# EAGLE design H0BR4 (EAGLE 9.6.1)

## Sheet 1 of 2
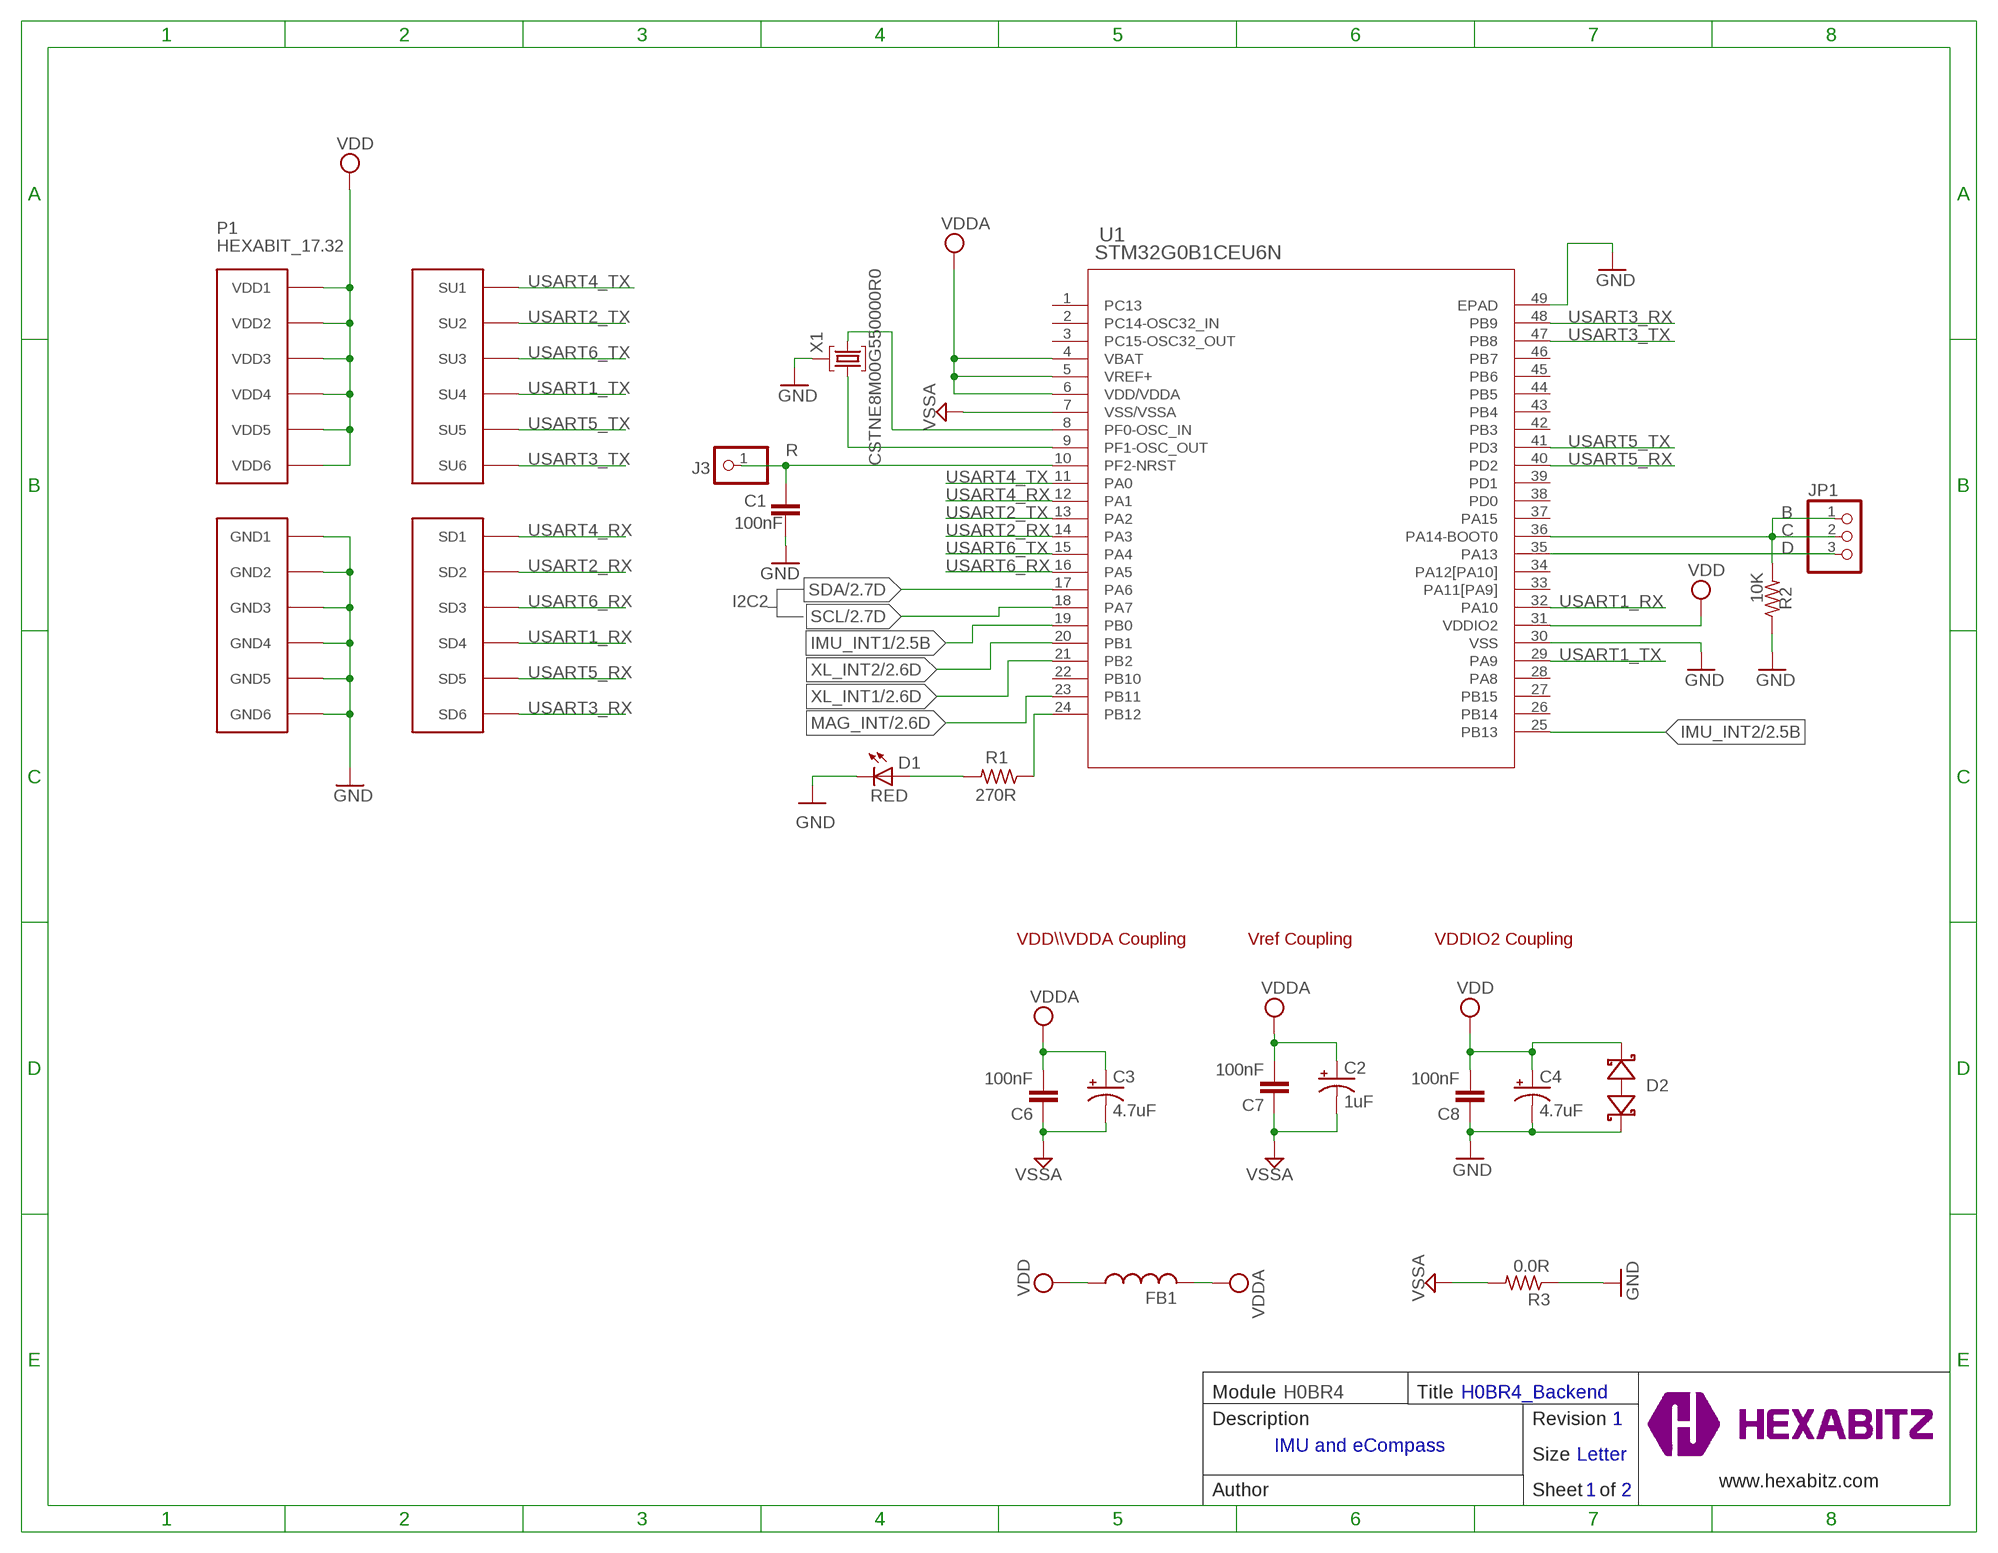
[diagram p0: schematic, sheet 1]

### Parts
C1  100nF  C-0603  [C-0603]
C2  1uF  C-0805-POL  [C-0805-POL]
C3  4.7uF  C-0805-POL  [C-0805-POL]
C4  4.7uF  C-0805-POL  [C-0805-POL]
C6  100nF  C-0603  [C-0603]
C7  100nF  C-0603  [C-0603]
C8  100nF  C-0603  [C-0603]
D1  RED  VLMS1300-GS08  [VLMS1300-GS08]
D2  BOURNS_CDSOD323-T03SCBOURNS_CDSOD323-T03SC_0_0  [BOURNS_CDSOD323-T03SC_0]
FB1  FB-TDK_MMZ1608Y300B  [FB-TDK_MMZ1608Y300B]
J3  PINHD-1X1  [1X01]
JP1  PINHD-1X3  [1X03]
P1  HEXABIT_17.32  [HEXABIT_17.32]
R1  270R  R-0603  [R-0603]
R2  10K  R-0603  [R-0603]
R3  0.0R  R-0603  [R-0603]
TRIMBLE-LOGO1  HEXA-LOGO  [HEXA-LOGO]
U1  STM32G0B1CEU6N  [HEXABITZ_ICS_QFN_B1CEU6_STM-L]
X1  CSTNE8M00G550000R0  XTALL_CSTCE8M00G52  [XTALL_CSTCE8M00G52]

### Nets
C: JP1.1 JP1.2 R2.2 U1.36(PA14-BOOT0)
D: JP1.3 U1.35(PA13)
GND: C1.1 C4.2(-) C8.1 D1.C D2.1(A) P1.PAD_PD7(GND1) P1.PAD_PD8(GND2) P1.PAD_PD9(GND3) P1.PAD_PD10(GND4) P1.PAD_PD11(GND5) P1.PAD_PD12(GND6) R2.1 R3.1 U1.30(VSS) U1.49(EPAD) X1.P$2 ; also sheet 2
GND1: C2.2(-) C3.2(-) C6.1 C7.1 R3.2 U1.7(VSS/VSSA) ; supply symbol labelled VSSA
IMU_INT1: U1.19(PB0) ; also sheet 2
IMU_INT2: U1.25(PB13) ; also sheet 2
MAG_INT: U1.23(PB11) ; also sheet 2
N$1: R1.1 U1.24(PB12)
N$3: U1.9(PF1-OSC_OUT) X1.P$3
N$4: D1.A R1.2
N$5: U1.8(PF0-OSC_IN) X1.P$1
R: C1.2 J3.1 U1.10(PF2-NRST)
SCL: U1.18(PA7) ; also sheet 2
SDA: U1.17(PA6) ; also sheet 2
USART1_RX: P1.PAD_PD4(SD4) U1.32(PA10)
USART1_TX: P1.PAD_PU4(SU4) U1.29(PA9)
USART2_RX: P1.PAD_PD2(SD2) U1.14(PA3)
USART2_TX: P1.PAD_PU2(SU2) U1.13(PA2)
USART3_RX: P1.PAD_PD6(SD6) U1.48(PB9)
USART3_TX: P1.PAD_PU6(SU6) U1.47(PB8)
USART4_RX: P1.PAD_PD1(SD1) U1.12(PA1)
USART4_TX: P1.PAD_PU1(SU1) U1.11(PA0)
USART5_RX: P1.PAD_PD5(SD5) U1.40(PD2)
USART5_TX: P1.PAD_PU5(SU5) U1.41(PD3)
USART6_RX: P1.PAD_PD3(SD3) U1.16(PA5)
USART6_TX: P1.PAD_PU3(SU3) U1.15(PA4)
VCC: C2.1(+) C3.1(+) C6.2 C7.2 FB1.2 U1.4(VBAT) U1.5(VREF+) U1.6(VDD/VDDA) ; supply symbol labelled VDDA
VDD: C4.1(+) C8.2 D2.2(C) FB1.1 P1.PAD_PU7(VDD1) P1.PAD_PU8(VDD2) P1.PAD_PU9(VDD3) P1.PAD_PU10(VDD4) P1.PAD_PU11(VDD5) P1.PAD_PU12(VDD6) U1.31(VDDIO2) ; also sheet 2
XL_INT1: U1.21(PB2) ; also sheet 2
XL_INT2: U1.20(PB1) ; also sheet 2
Unconnected: U1.1(PC13) U1.2(PC14-OSC32_IN) U1.3(PC15-OSC32_OUT) U1.22(PB10) U1.26(PB14) U1.27(PB15) U1.28(PA8) U1.33(PA11[PA9]) U1.34(PA12[PA10]) U1.37(PA15) U1.38(PD0) U1.39(PD1) U1.42(PB3) U1.43(PB4) U1.44(PB5) U1.45(PB6) U1.46(PB7)

### Notes on the sheet
- B
- I2C2
- VDD\\\VDDA Coupling | Vref Coupling | VDDIO2 Coupling
- Module | H0BR4 | Title | H0BR4_Backend
- Description | Revision | 1
- IMU and eCompass
- Size | Letter
- www.hexabitz.com
- Author | Sheet   of | 1 | 2
- C:/Users/Admin/Desktop/logodraft.bmp

## Sheet 2 of 2
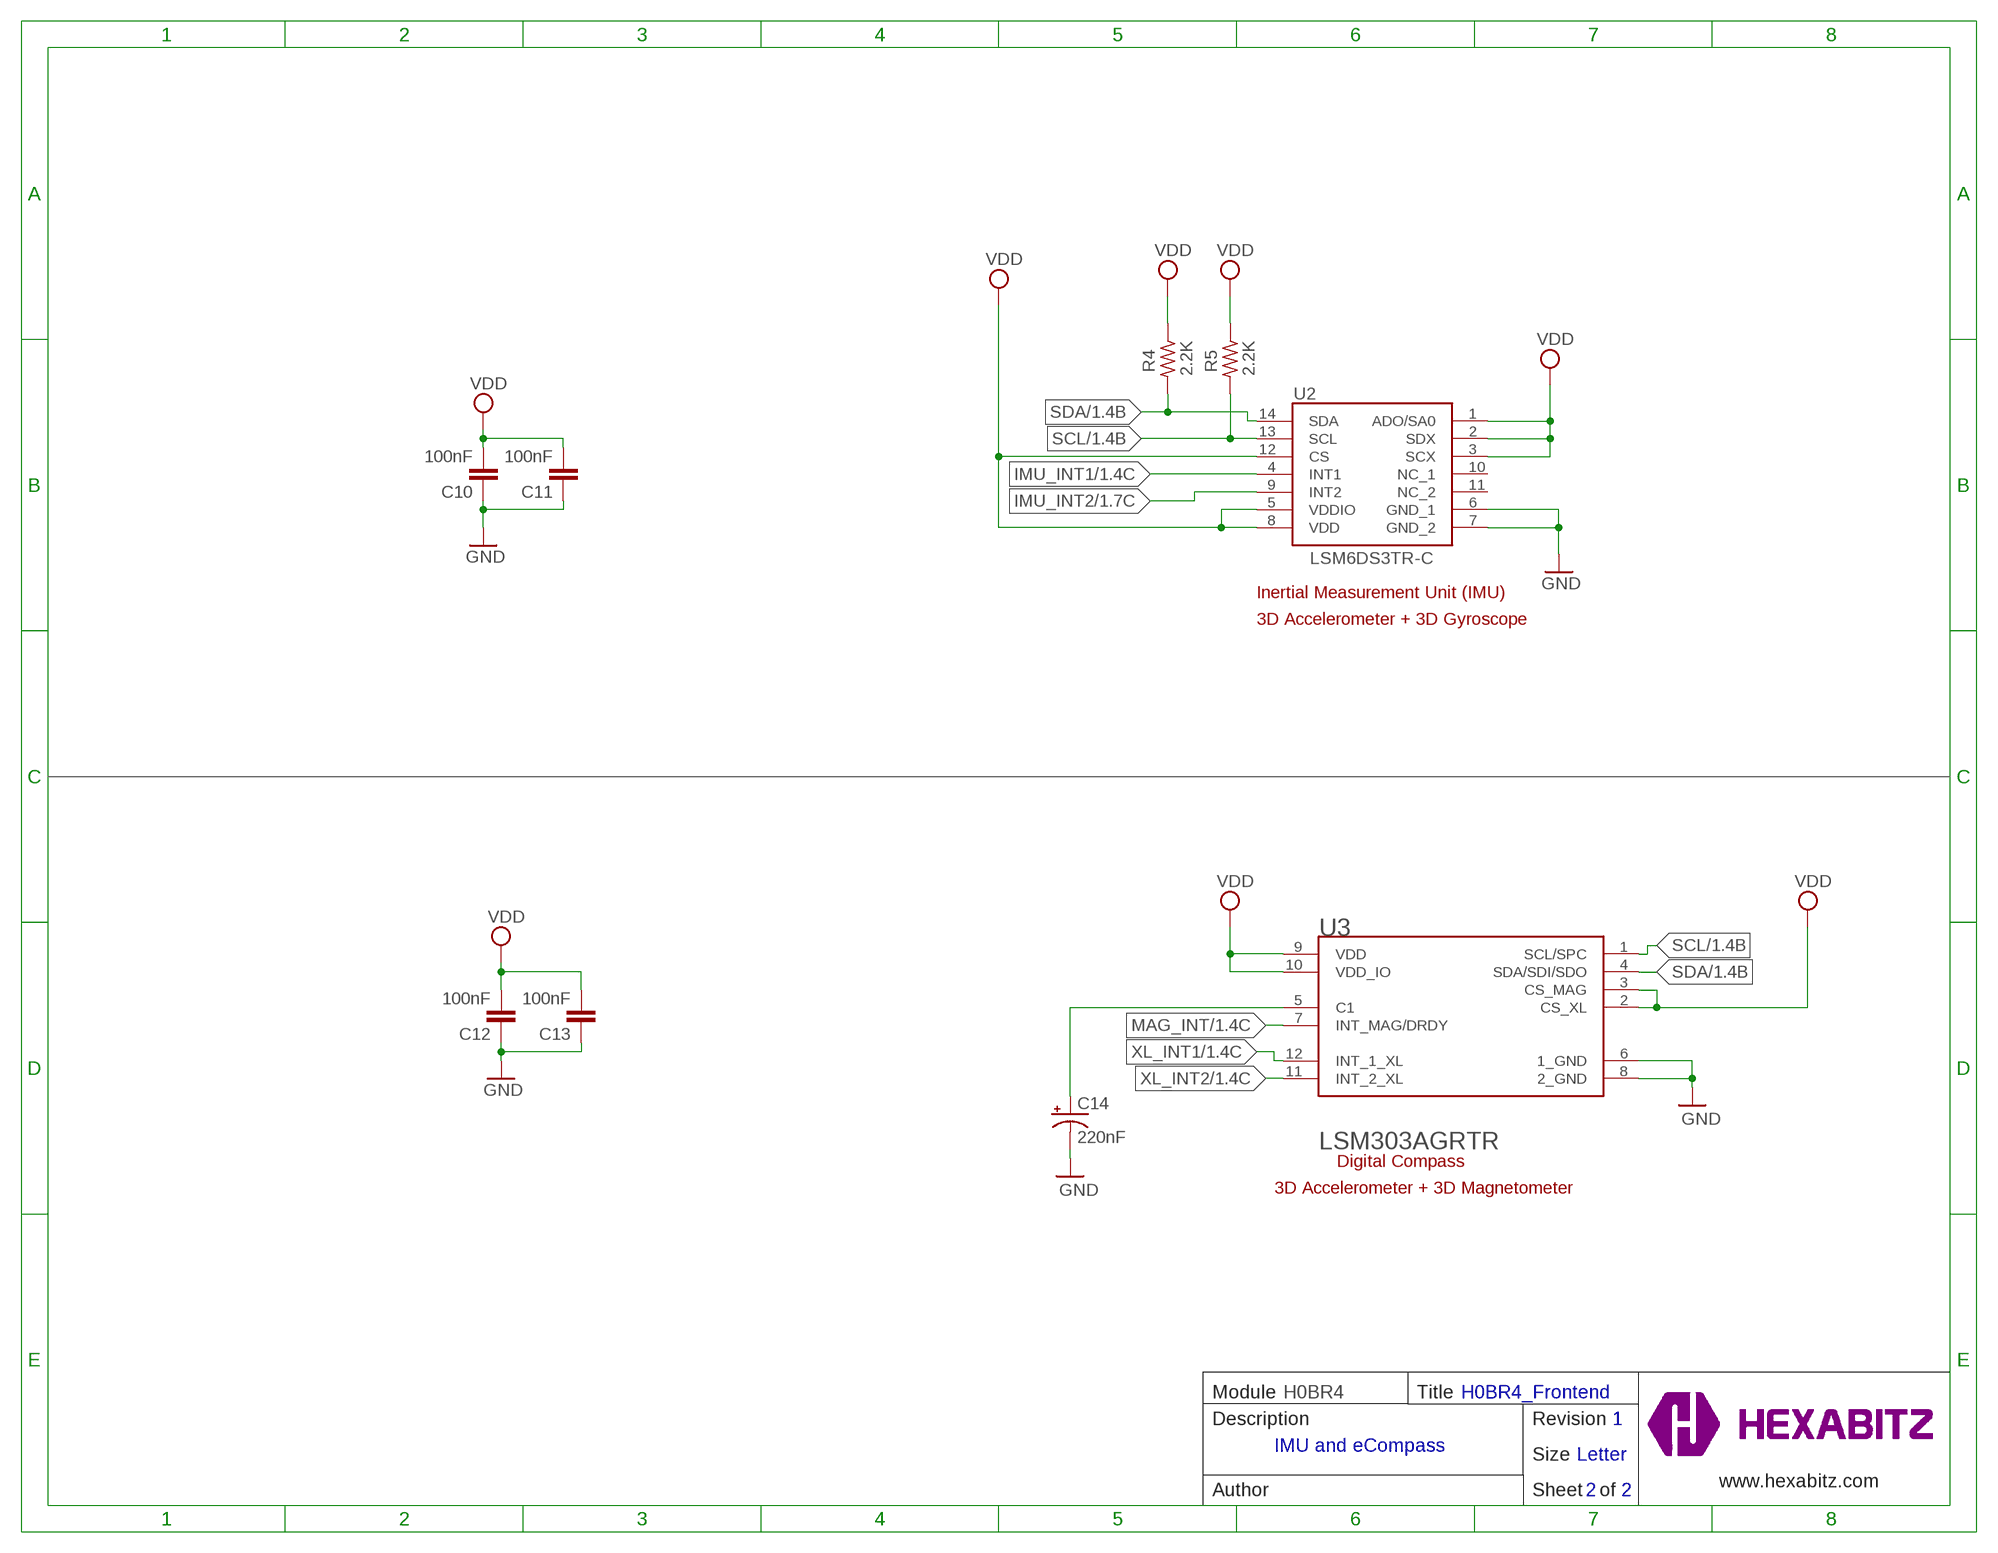
[diagram p1: schematic, sheet 2]

### Parts
C10  100nF  C-0603  [C-0603]
C11  100nF  C-0603  [C-0603]
C12  100nF  C-0603  [C-0603]
C13  100nF  C-0603  [C-0603]
C14  220nF  C-0805-POL  [C-0805-POL]
R4  2.2K  R-0603  [R-0603]
R5  2.2K  R-0603  [R-0603]
U2  LSM6DS3TR-C  [LGA-14(2.5X3X0.86)]
U3  STMICROELECTRONICS_LSM303AGRTRSTMICROELECTRONICS_LSM303AGRTR_0_0  [STMICROELECTRONICS_LSM303AGRTR_0]

### Nets
GND: C10.1 C11.1 C12.1 C13.1 C14.2(-) U2.6(GND_1) U2.7(GND_2) U3.6(1_GND) U3.8(2_GND) ; also sheet 1
IMU_INT1: U2.4(INT1) ; also sheet 1
IMU_INT2: U2.9(INT2) ; also sheet 1
MAG_INT: U3.7(INT_MAG/DRDY) ; also sheet 1
N$2: C14.1(+) U3.5(C1)
SCL: R5.2 U2.13(SCL) U3.1(SCL/SPC) ; also sheet 1
SDA: R4.2 U2.14(SDA) U3.4(SDA/SDI/SDO) ; also sheet 1
VDD: C10.2 C11.2 C12.2 C13.2 R4.1 R5.1 U2.1(ADO/SA0) U2.2(SDX) U2.3(SCX) U2.5(VDDIO) U2.8(VDD) U2.12(CS) U3.2(CS_XL) U3.3(CS_MAG) U3.9(VDD) U3.10(VDD_IO) ; also sheet 1
XL_INT1: U3.12(INT_1_XL) ; also sheet 1
XL_INT2: U3.11(INT_2_XL) ; also sheet 1
Unconnected: U2.10(NC_1) U2.11(NC_2)

### Notes on the sheet
- Inertial Measurement Unit (IMU)
- 3D Accelerometer + 3D Gyroscope
- Digital Compass
- 3D Accelerometer + 3D Magnetometer
- Module | H0BR4 | Title | H0BR4_Frontend
- Description | Revision | 1
- IMU and eCompass
- Size | Letter
- www.hexabitz.com
- Author | Sheet   of | 2 | 2

## Library data of the parts
C1 C6-C8 C10-C13 = HEXABITZ_RCLS:C-0603: CAP CER 10% X7R 0603; CAPACITANCE: 100nF; MFN: AVX CORPORATION; MPN: '0603YC104K4T2A; OCTOPART_URL: 'https://octopart.com/0603yc104k4t2a-avx+interconnect+%2F+elco-8120651; TOLERANCE: 10%; VOLTAGE_RATING: 16.0 V
C2 = HEXABITZ_RCLS:C-0805-POL: Cap Tant Solid SMD 2012; CAPACITANCE: 1.00uF; MFN: 'YAGEO [VA]; MPN: 'CC0805KKX7R7BB105; OCTOPART_URL: https://octopart.com/cc0805kkx7r7bb105-yageo-8376555?r=sp; TOLERANCE: 10%; VOLTAGE_RATING: 16.0 V
C3 C4 = HEXABITZ_RCLS:C-0805-POL: Cap Tant Solid SMD 2012; CAPACITANCE: 4.7uF; MFN: Panasonic; MPN: 10TPU4R7MSI; OCTOPART_URL: https://octopart.com/10tpu4r7msi-panasonic-29487748; TOLERANCE: 20%; VOLTAGE_RATING: 10.0 V
C14 = HEXABITZ_RCLS:C-0805-POL: Cap Tant Solid SMD 2012; CAPACITANCE: 4.7uF; MFN: KEMET; MPN: C0805C224K1RACTU; OCTOPART_URL: https://octopart.com/c0805c224k1ractu-kemet-12818106?r=sp; TOLERANCE: 20%; VOLTAGE_RATING: 10.0 V
D1 = HEXABITZ_USER_INTERFACE_PARTS:VLMS1300-GS08: Red 0603 130° Clear 54 mcd 2 V Surface Mount ChipLED ; Octopart Url : http://octopart.com/vlms1300-gs08-vishay-21709201; MFN: Vishay; MPN: VLMS1300-GS08; OCTOPART_URL: https://octopart.com/vlms1300-gs08-vishay-21709201?r=sp&s=0nXJNjGsSbWwqfqWlZv0EA
D2 = HEXABITZ_RCLS:BOURNS_CDSOD323-T03SC: CDSOD323-TxxSC - TVS Diode Series; DESCRIPTION: Dio Tvs Vwm 03V 500W Bidir Sod323 / Tape & Reel - 7" Reel; MFN: Bourns; MPN: CDSOD323-T03SC; OCTOPART_URL: https://octopart.com/cdsod323-t03sc-bourns-10487153?r=sp
FB1 = HEXABITZ_RCLS:FB-TDK_MMZ1608Y300B: Ferrite Beads Multi-Layer 30Ohm 25% 100MHz 1.5A 50mOhm DCR 0603; MFN: TDK; MPN: MMZ1608Y300BTA00; OCTOPART_URL: https://octopart.com/mmz1608y300bta00-tdk-7906990?r=sp
J3 = HEXABITZ_USER_INTERFACE_PARTS:PINHD-1X1: PIN HEADER; MFN: TE Connectivity; MPN: 87227-1; OCTOPART_URL: https://octopart.com/87227-1-te+connectivity-39512052?r=sp
JP1 = pinhead:PINHD-1X3: PIN HEADER
P1 = hexabitz_connectors:HEXABIT_?: Hexabitz Hexagon Module Connector Hexagon side length = 28.87mm.
R1 = HEXABITZ_RCLS:R-0603: Thick Film Resistors - SMD 0603; MFN: 'Panasonic; MPN: 'ERJ-3GEYJ271V; OCTOPART_URL: https://octopart.com/erj-3geyj271v-panasonic-55560546?r=sp; RESISTANCE: 270R
R2 = HEXABITZ_RCLS:R-0603: Thick Film Resistors - SMD 0603; MFN: Vishay; MPN: '060300J0103T5E; OCTOPART_URL: https://octopart.com/search?q=060300J0103T5E&currency=USD&specs=0; RESISTANCE: 10K
R3 = HEXABITZ_RCLS:R-0603: Thick Film Resistors - SMD 0603; MFN: YAGEO [VR]; MPN: RC0603JR-070RL; OCTOPART_URL: https://octopart.com/rc0603jr-070rl-yageo-1241539?r=sp; RESISTANCE: 0R
R4 R5 = HEXABITZ_RCLS:R-0603: Thick Film Resistors - SMD 0603; MFN: Yageo; MPN: RC0603FR-072K2L; OCTOPART_URL: https://octopart.com/rc0603fr-072k2l-yageo-1214512?r=sp; RESISTANCE: 2.2K Ohm; TOLERANCE: 5%
TRIMBLE-LOGO1 = HEXABITZ_USER_INTERFACE_PARTS:HEXA-LOGO: Trimble-Logo
U1 = HEXABITZ_ICs:STM32G0B1CEU6N
U2 = HEXABITZ_ICs:LSM6DS3TR-C: STMicroelectronics iNEMO inertial module: 3D accelerometer and 3D gyroscope Source: Datasheet <http://www.st.com/resource/en/datasheet/lsm6ds3tr-c.pdf>; DESCRIPTION: STMicroelectronics iNEMO inertial module: 3D accelerometer and 3D gyroscope; HEIGHT: mm; MFN: STMicroelectronics; MPN: LSM6DS3TR-C; OCTOPART_ID: b93b7300354766fc; OCTOPART_URL: https://www.mouser.com/Search/Refine.aspx?Keyword=N%2FA
U3 = HEXABITZ_ICs:STMICROELECTRONICS_LSM303AGRTR: Accelerometer, Magnetometer, Temperature, 3 Axis Sensor I²C, SPI Output; ACCEL_RANGE: 2/4/8/16g; ACCEL_RESOLUTION: 16bits; AUTOMOTIVE: No; CENTROID_NOT_SPECIFIED: No; DATASHEET: https://www.st.com/resource/en/datasheet/lsm303agr.pdf; DEVICE_CLASS_L1: Sensors; DEVICE_CLASS_L2: Motion Sensors; DEVICE_CLASS_L3: Inertial Measurement Units (IMUs); DIGIKEY_DESCRIPTION: IMU ACCEL/MAG I2C/SPI 12LGA; DIGIKEY_PART_NUMBER: 497-16527-1-ND; FOOTPRINT_URL: https://www.st.com/content/ccc/resource/technical/document/technical_note/73/17/9c/16/dd/96/4a/01/CD00134799.pdf/files/CD00134799.pdf/jcr:content/translations/en.CD00134799.pdf; FOOTPRINT_VARIANT_NAME_0: Recommended_Land_Pattern; HEIGHT: 1mm; LEAD_FREE: Yes; MAG_SENSE_RANGE: 49.152gauss (g); MAX_SUPPLY_VOLTAGE: 3.6V; MFG_PACKAGE_IDENT: LGA-12-8487206; MFG_PACKAGE_IDENT_DATE: 0; MFG_PACKAGE_IDENT_REV: 3; MFN: STMicroelectronics; MIN_SUPPLY_VOLTAGE: 1.71V; MOUSER_DESCRIPTION: IMUs - Inertial Measurement Units Ultra-compact high-performance e-compass 3D accelerometer and 3D magnetometer module; MOUSER_PART_NUMBER: 511-LSM303AGRTR; MPN: LSM303AGRTR; OCTOPART_URL: https://octopart.com/lsm303agrtr-stmicroelectronics-59386630?r=sp; OPERATING_SUPPLY_CURRENT: 3.7-200uA; PACKAGE: LGA12; PREFIX: U; RESOLUTION: 16bits; ROHS: Yes; SENSOR_OUTPUT: I2C,SPI; SENSOR_TYPE: Temperature,Accelerometer,Magnetometer; TEMPERATURE_RANGE_HIGH: +85°C; TEMPERATURE_RANGE_LOW: -40°C; VERIFICATION_VERSION: 0.0.0.3
X1 = HEXABITZ_OTHER_PARTS:XTALL_CSTCE8M00G52: MURATA CSTCE8M00G52-R0 RESONATOR, SMD, 8MHZ ; Octopart Url : https://octopart.com/cstce8m00g52-r0-murata-7145559; MFN: Murata; MPN: CSTNE8M00G550000R0; OCTOPART_URL: https://octopart.com/cstne8m00g550000r0-murata-91406934?r=sp

## Board
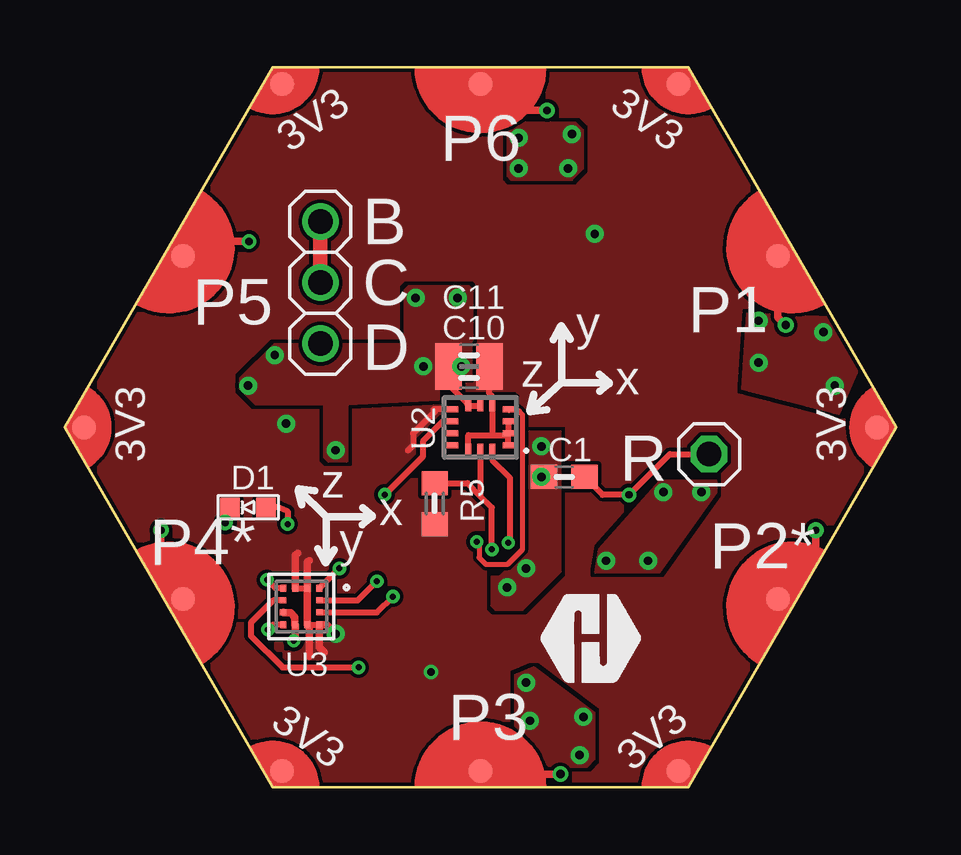
[diagram p2: board, top side]
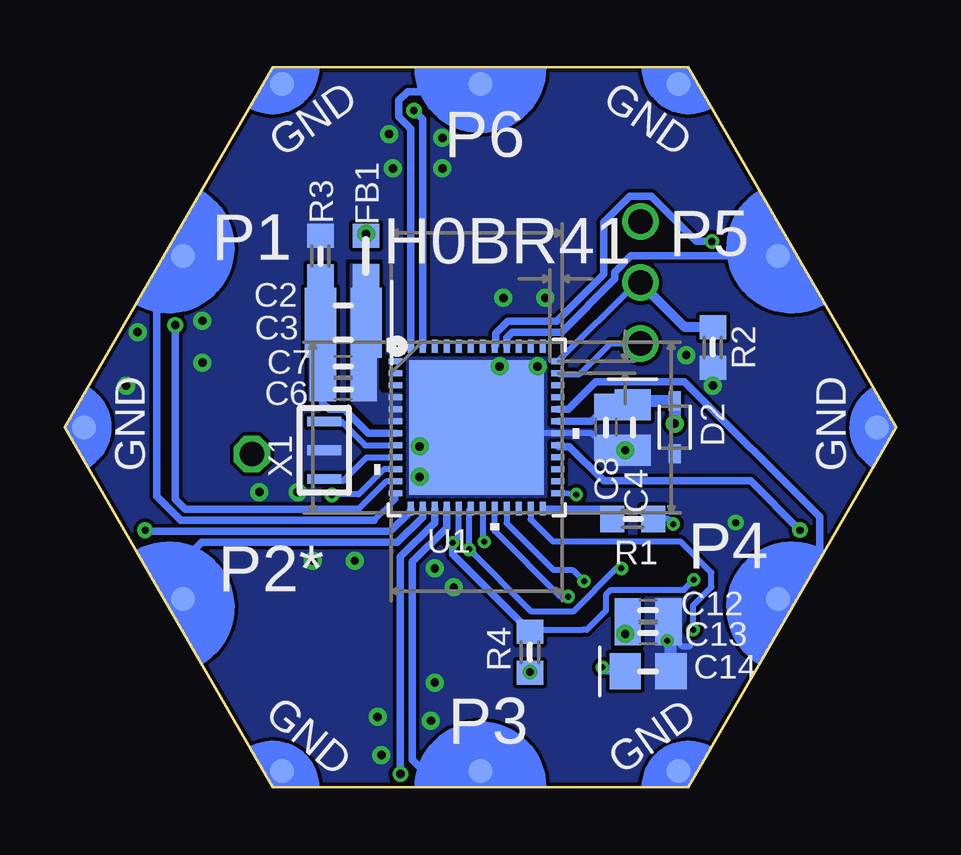
[diagram p3: board, bottom side, seen from below]

Size 34.64 x 30 mm. Coordinates in mm from the lower left corner, seen from the top.
Copper layers (1*16): Top 0.035mm / dielectric 1.5mm / Bottom 0.035mm
Design rules "2_layer *": minimum track width 6mil, minimum drill 0.2mm, track to track 6mil, track to pad 6mil, pad to pad 6mil, via to via 6mil, smd to smd 0mil, copper to edge 6mil, drill to drill 8mil, minimum pad ring 10mil, minimum via ring 6mil, stop-mask expansion 2mil, vias tented up to drill 15mil, thermal gap 10mil

### Footprints (pad centres in the part's own frame; a part is rotated, then mirrored left to right if it is on the bottom)
C-0603 = smd 1.1 x 1: 1 -0.85,0; 2 0.85,0
C-0805-POL = smd 1.3 x 1.5: 1 -0.95,0; 2 0.95,0
VLMS1300-GS08 = smd 0.8 x 0.8: A 0,0.75; C 0,-0.75
BOURNS_CDSOD323-T03SC_0 = smd 0.8 x 0.5: 1 -1.1,0; 2 1.1,0
FB-TDK_MMZ1608Y300B = smd 1 x 1.1: 1 -0.85,0; 2 0.85,0
1X01 = drill 1.016 octagon: 1 0,0
1X03 = drill 1.016: 1 -2.54,0; 2 0,0; 3 2.54,0
HEXABIT_17.32 = smd 1 x 1 bottom: PAD_PD1 12.39,7.15; PAD_PD2 12.39,-7.15; PAD_PD3 0,-14.31; PAD_PD4 -12.39,-7.15; PAD_PD5 -12.39,7.15; PAD_PD6 0,14.31; PAD_PD7 8.26,14.31; PAD_PD8 16.52,0; PAD_PD9 8.26,-14.31; PAD_PD10 -8.26,-14.31; PAD_PD11 -16.52,0; PAD_PD12 -8.26,14.31 | smd 1 x 1: PAD_PU1 12.39,7.15; PAD_PU2 12.39,-7.15; PAD_PU3 0,-14.31; PAD_PU4 -12.39,-7.15; PAD_PU5 -12.39,7.15; PAD_PU6 0,14.31; PAD_PU7 8.26,14.31; PAD_PU8 16.52,0; PAD_PU9 8.26,-14.31; PAD_PU10 -8.26,-14.31; PAD_PU11 -16.52,0; PAD_PU12 -8.26,14.31
R-0603 = smd 1 x 1.1: 1 -0.85,0; 2 0.85,0
HEXABITZ_ICS_QFN_B1CEU6_STM-L = smd 0.55 x 0.254: 1 -3.38,2.751; 2 -3.38,2.251; 3 -3.38,1.75; 4 -3.38,1.25; 5 -3.38,0.75; 6 -3.38,0.25; 7 -3.38,-0.25; 8 -3.38,-0.75; 9 -3.38,-1.25; 10 -3.38,-1.75; 11 -3.38,-2.251; 12 -3.38,-2.751; 25 3.38,-2.751; 26 3.38,-2.251; 27 3.38,-1.75; 28 3.38,-1.25; 29 3.38,-0.75; 30 3.38,-0.25; 31 3.38,0.25; 32 3.38,0.75; 33 3.38,1.25; 34 3.38,1.75; 35 3.38,2.251; 36 3.38,2.751 | smd 0.254 x 0.55: 13 -2.751,-3.38; 14 -2.251,-3.38; 15 -1.75,-3.38; 16 -1.25,-3.38; 17 -0.75,-3.38; 18 -0.25,-3.38; 19 0.25,-3.38; 20 0.75,-3.38; 21 1.25,-3.38; 22 1.75,-3.38; 23 2.251,-3.38; 24 2.751,-3.38; 37 2.751,3.38; 38 2.251,3.38; 39 1.75,3.38; 40 1.25,3.38; 41 0.75,3.38; 42 0.25,3.38; 43 -0.25,3.38; 44 -0.75,3.38; 45 -1.25,3.38; 46 -1.75,3.38; 47 -2.251,3.38; 48 -2.751,3.38 | smd 5.6 x 5.6: 49 0,0
LGA-14(2.5X3X0.86) = smd 0.475 x 0.25: 1 -1.163,0.75; 2 -1.163,0.25; 3 -1.163,-0.25; 4 -1.163,-0.75; 8 1.163,-0.75; 9 1.163,-0.25; 10 1.163,0.25; 11 1.163,0.75 | smd 0.25 x 0.475: 5 -0.5,-0.912; 6 0,-0.912; 7 0.5,-0.912; 12 0.5,0.912; 13 0,0.912; 14 -0.5,0.912
STMICROELECTRONICS_LSM303AGRTR_0 = smd 0.275 x 0.25: 1 -0.762,0.75; 2 -0.762,0.25; 3 -0.762,-0.25; 4 -0.762,-0.75; 7 0.762,-0.75; 8 0.762,-0.25; 9 0.762,0.25; 10 0.762,0.75 | smd 0.25 x 0.275: 5 -0.25,-0.762; 6 0.25,-0.762; 11 0.25,0.762; 12 -0.25,0.762
XTALL_CSTCE8M00G52 = smd 1.4 x 0.4: P$1 0,1.2; P$2 0,0; P$3 0,-1.2

### Placement (x,y rotation side)
C1  20.81,12.94 0 top
C2  23.04,20.08 180 bottom
C3  23.04,18.65 180 bottom
C4  10.97,15 270 bottom
C6  23.04,16.59 0 bottom
C7  23.04,17.54 0 bottom
C8  12.08,15 90 bottom
C10  16.84,17.06 0 top
C11  16.84,18.02 0 top
C12  10.34,7.38 180 bottom
C13  10.34,6.43 180 bottom
C14  10.34,4.84 0 bottom
D1  7.64,11.67 270 top
D2  9.22,15 90 bottom
FB1  22.08,22.14 270 bottom
J3  26.84,13.89 0 top
JP1  10.65,21.03 270 top
P1  17.32,15 0 top
R1  10.97,11.19 0 bottom
R2  7.64,18.33 90 bottom
R3  23.99,22.14 270 bottom
R4  15.26,5.63 90 bottom
R5  15.42,11.83 90 top
TRIMBLE-LOGO1  21.92,4.36 0 top
U1  17.48,15 0 bottom
U2  17.32,15 180 top
U3  9.86,7.54 270 top
X1  23.83,14.05 0 bottom

### Tracks (layer width: path | path; a pad name or v marks a point on that pad's centre or on a via)
C
  Top 0.61: JP1.2 JP1.1
  Bottom 0.254: U1.36 10.82,21.03 JP1.2
  Bottom 0.406: R2.2 8.8,19.18 JP1.2
D
  Bottom 0.254: JP1.3 11.92,18.49 13.19,17.22 14.07,17.22 U1.35
GND  (via drill 0.25 pad 0.55, 0.3 pad 0.65, 0.35 pad 0.75)
  Top 0.254: U2.6 U2.7 16.75,15.98 16.75,16.02 15.99,16.78 C10.1 | D1.C 6.68,11.46 v6.68,11.03
  Top 0.305: U3.8 9.59,6.76 | U3.6 9.12,7.27 9.41,7.27 9.59,7.09 9.59,6.8 U3.8 | U3.8 9.61,6.18 v9.54,6.11
  Top 0.508: C10.1 C11.1
  Bottom 0.254: C13.1 8.94,5.88 8.59,5.88 | C8.1 12.68,14.75 14.02,14.75 14.04,14.77 17.28,14.77 17.48,14.97 U1.49
  Bottom 0.508: C14.2 9.39,6.33 C13.1 | C8.1 11.07,14.15 C4.2
  other vias: 19.86,12.94 14.94,17.54 16.53,17.54 16.37,20.4 14.62,20.4 21.45,1.35 21.61,2.94 19.23,4.36 19.38,2.78 22.56,9.44 24.3,9.44 24.94,12.3 26.53,12.3 28.91,19.45 28.91,17.7 32.08,16.75 31.61,18.97 21.13,27.22 20.97,25.8 18.91,27.07 18.91,25.8 8.75,18.02 7.64,16.75 19.86,14.21 19.23,9.13 18.43,8.33 11.29,14.05
  pour Bottom (rank 2, no thermals): 0.02,15 8.59,29.92 25.89,29.92 34.47,15 25.89,0.08 8.75,0.08
  pour Top (no thermals): 14.46,17.06 16.84,17.06 17,17.22 17,20.71 16.84,20.87 14.3,20.87 14.14,20.71 14.14,17.38
  pour Top (no thermals): 18.75,4.68 18.75,2.3 20.18,0.87 21.77,0.87 22.08,1.19 22.08,3.09 19.54,5
  pour Top (no thermals): 22.08,8.97 24.78,8.97 27.16,12.3 27.16,12.78 24.78,12.78 22.24,9.92
  pour Top (no thermals): 32.25,15.56 28.22,16.6 28.43,19.76 31.93,19.6 33.04,17.38
  pour Top (no thermals): 18.43,27.54 18.43,25.48 18.59,25.32 21.13,25.32 21.61,25.8 21.61,27.38 21.29,27.7 18.59,27.7
  pour Top (no thermals): 15.57,18.49 15.57,16.14 11.76,15.95 11.76,13.57 10.97,13.57 10.81,13.73 10.81,15.95 10.8,15.94 7.96,15.94 7.32,16.59 7.32,17.06 8.75,18.49
  pour Top (no thermals): 19.23,14.84 20.65,14.84 20.65,8.97 19.07,7.38 17.96,7.38 17.8,7.54 17.8,8.81 18.11,8.81 19.23,9.92
GND1
  Bottom 0.254: 23.74,16.59 C6.1
  Bottom 0.305: U1.7 22,14.75 23,15.75 23.63,15.75 23.89,16.01 C6.1
  pour Bottom (no thermals): 24.46,16.11 24.46,21.67 23.51,21.67 23.51,16.11
IMU_INT1  (via drill 0.25 pad 0.55)
  Top 0.203: 18.5,15.73 18.87,15.73 19.07,15.53 19.07,9.91 18.44,9.28 17.55,9.28 17.26,9.57 17.26,10.13 v17.16,10.24
  Top 0.254: U2.4 18.5,15.73
  Bottom 0.254: U1.19 17.23,10.3 v17.16,10.24
IMU_INT2  (via drill 0.25 pad 0.55)
  Top 0.254: U2.9 15.74,15.25 14.92,14.42 14.92,13.79 v13.33,12.2
  Bottom 0.254: v13.33,12.2 13.82,12.25 U1.25
MAG_INT  (via drill 0.25 pad 0.55)
  Top 0.254: U3.7 8.66,6.78 v8.46,6.58
  Bottom 0.254: v8.46,6.58 8.46,7.58 7.7,8.35 7.7,8.95 8.98,10.24 14.3,10.24 15.23,11.17 U1.23
N$1
  Bottom 0.254: R1.1 12.25,11.62 U1.24
N$2  (via drill 0.25 pad 0.55)
  Top 0.254: U3.5 8.68,7.79 7.76,6.86 7.76,6.32 9.07,5 v12.24,5
  Bottom 0.254: v12.24,5 12.08,4.84 C14.1
N$3
  Bottom 0.254: X1.P$3 23.76,12.78 23.04,12.78 22.06,13.75 U1.9
N$4  (via drill 0.25 pad 0.55)
  Top 0.254: v9.28,10.97 9.28,11.5 8.93,11.67 D1.A
  Bottom 0.254: v9.28,10.97 9.5,11.19 R1.2
N$5
  Bottom 0.254: X1.P$1 23.12,15.25 22.13,14.25 U1.8
R  (via drill 0.3 pad 0.6)
  Top 0.254: C1.2 22.41,12.19 v23.51,12.19 25.21,13.89 J3.1
  Bottom 0.254: U1.10 21.35,13.25 22.39,12.21 23.34,12.21 23.35,12.19 v23.51,12.19
SCL  (via drill 0.25 pad 0.55)
  Top 0.254: U3.1 10.64,8.33 10.65,8.33 v11.45,9.13 | R5.2 16.79,12.68 17.32,12.14 | v17.8,9.92 17.8,11.67 17.32,12.14 | U2.13 17.32,12.14
  Bottom 0.254: 17.75,9.95 v17.8,9.92 | v11.45,9.13 11.65,9.13 13.45,7.32 15.2,7.32 v17.8,9.92 | v17.8,9.92 17.8,11.55 U1.18
SDA  (via drill 0.25 pad 0.55)
  Top 0.254: v18.47,10.19 18.53,10.25 18.53,12.92 17.82,13.63 U2.14 | U3.4 8.78,8.3 v8.43,8.65
  Bottom 0.254: R4.2 15.18,6.56 13.08,6.56 13.07,6.56 12.9,6.56 12.09,7.37 12.09,8.03 11.88,8.24 8.84,8.24 v8.43,8.65 | v18.47,10.19 18.23,10.44 U1.17
  Bottom 0.305: v18.47,10.19 18.47,9.72 15.26,6.5 R4.2
USART1_RX
  Bottom 0.305: U1.32 13.66,15.75 12.51,16.9 8.82,16.9 3.19,11.27 3.19,9.88 3.59,9.19 P1.PAD_PD4
USART1_TX  (via drill 0.3 pad 0.65)
  Top 0.305: v4.01,10.72 4.01,8.77 P1.PAD_PU4
  Bottom 0.305: U1.29 14.05,14.2 13.62,14.2 12.19,12.78 6.06,12.78 v4.01,10.72
USART2_RX
  Bottom 0.305: U1.14 19.73,11.27 20.78,10.21 28.93,10.21 30.18,8.97 30.18,8.32 P1.PAD_PD2
USART2_TX  (via drill 0.3 pad 0.65)
  Top 0.305: v31.29,10.71 31.29,9.6 31.05,9.19 P1.PAD_PU2
  Bottom 0.305: v31.29,10.71 31.25,10.67 21.07,10.67 20.23,11.52 U1.13
USART3_RX
  Bottom 0.305: P1.PAD_PD6 17.64,29 20.36,29 20.72,28.63 20.72,27.95 20.23,27.45 U1.48
USART3_TX  (via drill 0.3 pad 0.65)
  Top 0.305: v20.09,28.21 18.42,28.21 P1.PAD_PU6
  Bottom 0.305: U1.47 19.73,27.84 v20.09,28.21
USART4_RX
  Bottom 0.254: 21.74,11.13 20.86,12.01 U1.12
  Bottom 0.305: 21.74,11.13 29.8,11.13 30.81,12.14 30.81,21.05 P1.PAD_PD1
USART4_TX  (via drill 0.35)
  Top 0.305: v30.04,19.27 29.71,19.6 P1.PAD_PU1
  Bottom 0.254: U1.11 21.24,12.75 22.41,11.59
  Bottom 0.305: 22.41,11.59 29.61,11.59 30.04,12.01 v30.04,19.27
USART5_RX
  Bottom 0.305: P1.PAD_PD5 11.05,22.14 11.72,21.47 11.72,21.19 13.94,18.97 15.99,18.97 16.23,18.73 U1.40
USART5_TX  (via drill 0.3 pad 0.6)
  Top 0.305: v7.68,22.75 5.53,22.75 P1.PAD_PU5
  Bottom 0.305: v7.68,22.75 8.32,22.75 10.21,24.64 11.09,24.64 12.18,23.56 12.18,21.38 14.13,19.43 16.18,19.43 16.69,18.92 16.69,18.42 U1.41
USART6_RX
  Bottom 0.305: P1.PAD_PD3 19.7,0.69 20.16,1.15 20.16,9.4 18.73,10.83 U1.16
USART6_TX  (via drill 0.35)
  Top 0.305: P1.PAD_PU3 17.46,0.55 v20.65,0.55
  Bottom 0.305: U1.15 19.23,11.03 20.65,9.6 v20.65,0.55
VCC
  pour Bottom (no thermals): 20.65,15.16 21.77,15.16 22.72,16.11 22.72,21.83 21.61,21.83 21.61,16.59 21.45,16.43 20.65,16.43
VDD  (via drill 0.3 pad 0.6, 0.35 pad 0.75)
  Top 0.254: U3.3 U3.2 | U3.9 U3.10 | U2.1 18.48,14.68 | 18.48,14.68 U2.2 U2.3 | U2.12 16.82,14.68 17.82,14.68 | 17.82,14.68 18.48,14.68 | 17.82,14.68 U2.5 17.8,15.93 17.8,16.3 17.69,16.4 C10.2 | U2.8 15.36,15.75 15.44,15.68 14.51,14.75 14.51,14.25 14.3,14.05
  Top 0.305: U3.3 9.61,9.67 9.7,9.76 | 10.18,9.44 10.11,9.38 U3.2 U3.9 10.18,6.71 10.18,5.47 | 10.81,5.63 10.61,5.84 U3.10 10.91,6.78 v11.29,6.4
  Top 0.406: 17.67,18 C11.2
  Top 0.508: C10.2 C11.2
  Bottom 0.254: FB1.1 v22.08,23.06 | R4.1 v15.26,4.81 | C13.2 11.26,6.43 v11.29,6.4
  Bottom 0.305: U1.31 12.68,15.25 C8.2 11.07,15.85 C4.1
  Bottom 0.508: C13.2 C12.2 | C4.1 10.82,16.1 D2.2 v9.22,15.16
  pour Top (rank 2, no thermals): 0.02,15 8.59,29.92 25.89,29.92 34.47,15 25.89,0.08 8.75,0.08
  cutout Top (no thermals): 15.73,16.43 15.73,13.57 18.91,13.57 18.91,16.27 18.75,16.43
  cutout Top (no thermals): 8.43,8.97 11.29,8.97 11.29,6.27 11.13,6.11 8.75,6.11 8.43,6.43
XL_INT1  (via drill 0.25 pad 0.55)
  Top 0.254: U3.12 12.2,7.79 v13,8.59
  Bottom 0.254: v13,8.59 13.48,9.07 14.29,9.07 16.21,10.99 16.23,11.01 U1.21
XL_INT2  (via drill 0.25 pad 0.55)
  Top 0.254: v13.67,7.96 13.01,7.29 U3.11
  Bottom 0.254: v13.67,7.96 13.99,7.96 16.73,10.69 U1.20

### Text on the board
tPlace: 3V3 | 3V3 | P6 | P5 | P1 | y | z | x | 3V3 | 3V3 | z | x | P4* | y | P2* | P3 | 3V3 | 3V3
bPlace: GND | GND | P6 | P5 | H0BR41 | P1 | GND | GND | P4 | U1 | P2* | P3 | GND | GND
tNames: B | C | D | R